# Altium schematic sheet LM317.SchDoc
size A4
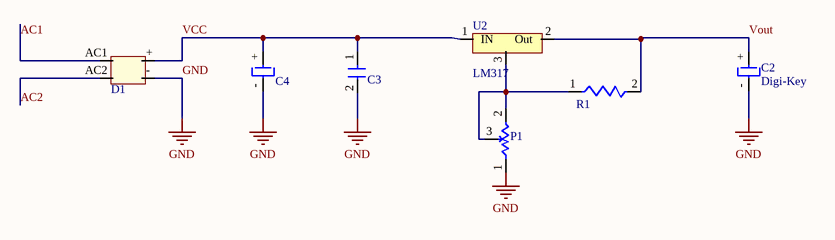
[diagram p0: LM317.SchDoc]

## Parts
C2  Digi-Key  [Cap2]
C3  Cap  [Cap1]  (value not drawn)
C4  2200uF  [CAP3]  (value not drawn)
D1  KoptuDiyot  [2W10]  (value not drawn)
P1  Pot  [Pot]  (value not drawn)
R1  Res  [R1]  (value not drawn)
U2  LM317  [TO220]

## Nets
GND: C2.- C3.2 C4.- D1.- P1.1
AC1: D1.AC1
AC2: D1.AC2
VCC: C3.1 C4.+ D1.+ U2.1(IN)
Vout: C2.+ R1.2 U2.2(Out)
NetP1_2: P1.2 P1.3 R1.1 U2.3

## Library data of the parts
C2 = B0510-2R5224-R: CAP SUPER 0.22F 2.5V RADIAL; Manufacturer: Eaton Bussmann; Capacitance: 220mF; Tolerance: -20%, +80%; ESR (Equivalent Series Resistance): 2 Ohm; Lifetime @ Temp.: 1000 Hrs @ 70°C; Supplier 1: Digi-Key; Manufacturer Part Number: B0510-2R5224-R; RoHS: RoHS Compliant; Category: Capacitors; Stock 1: 17500; Pricing 1: 1=1.67, 10=1.32, 50=1.144, 100=0.99, 500=0.748, 1000=0.66, 5000=0.594, 10000=0.572, 25000=0.55 (USD); Packaging: Bulk; Voltage - Rated: 2.5V; Mounting Type: Through Hole; Package / Case: Radial, Can; Lead Spacing: 0.079" (2.00mm); Size / Dimension: 0.217" Dia (5.50mm); Height - Seated (Max): 0.472" (12.00mm); Operating Temperature: -25°C ~ 70°C; ComponentLink1URL: http://www.cooperindustries.com/content/dam/public/bussmann/Electronics/Resources/product-datasheets/Bus_Elx_DS_4390_B_Series.pdf; ComponentLink1Description: http://www.cooperindustries.com/content/dam/public/bussmann/Electronics/Resources/product-datasheets/Bus_Elx_DS_4390_B_Series.pdf
C3 = R82DC3100DQ50J: CAP FILM 0.1UF 63VDC RADIAL; Manufacturer: Kemet; Capacitance: 0.1µF; Tolerance: ±5%; Voltage Rating - AC: 40V; Voltage Rating - DC: 63V; Dielectric Material: Polyester, Metallized - Stacked; Supplier 1: Digi-Key; Manufacturer Part Number: R82DC3100DQ50J; RoHS: RoHS Compliant; Category: Capacitors; Stock 1: 250000; Pricing 1: 3500=0.0582, 7000=0.05384, 10500=0.05092, 17500=0.04831, 24500=0.04656, 87500=0.04365, 175000=0.03856 (USD); Packaging: Tape & Box (TB); ESR (Equivalent Series Resistance): -; Operating Temperature: -55°C ~ 105°C; Mounting Type: Through Hole; Package / Case: Radial; Size / Dimension: 0.283" L x 0.098" W (7.20mm x 2.50mm); Height - Seated (Max): 0.260" (6.60mm); Termination: PC Pins; Lead Spacing: 0.197" (5.00mm); Applications: General Purpose; Features: -; ComponentLink1URL: http://www.kemet.com/docfinder?Partnumber=R82; ComponentLink1Description: http://www.kemet.com/docfinder?Partnumber=R82
C4 = ECA-1VM222: CAP ALUM 2200UF 35V 20% RADIAL; Manufacturer: Panasonic Electronic Components; Capacitance: 2200µF; Lifetime @ Temp.: 2000 Hrs @ 85°C; Ripple Current: 1.25A; Supplier 1: Digi-Key; Manufacturer Part Number: ECA-1VM222; RoHS: RoHS Compliant; Category: Capacitors; Stock 1: 3193; Pricing 1: 1=1.13, 50=0.7724, 100=0.6685, 500=0.50508, 1000=0.44565, 5000=0.40109, 10000=0.38623, 25000=0.37138 (USD); Packaging: Bulk; Tolerance: ±20%; Voltage Rating: 35V; ESR (Equivalent Series Resistance): -; Operating Temperature: -40°C ~ 85°C; Type: -; Applications: General Purpose; Impedance: -; Lead Spacing: 0.295" (7.50mm); Size / Dimension: 0.630" Dia (16.00mm); Height - Seated (Max): 1.063" (27.00mm); Surface Mount Land Size: -; Mounting Type: Through Hole; Package / Case: Radial, Can; ComponentLink1URL: http://industrial.panasonic.com/www-cgi/jvcr13pz.cgi?E+PZ+3+ABA0012+ECA1VM222+7+WW; ComponentLink1Description: http://industrial.panasonic.com/www-cgi/jvcr13pz.cgi?E+PZ+3+ABA0012+ECA1VM222+7+WW
D1 = 2W10G-E4/51: RECTIFIER BRIDGE 2A 1000V WOG; Manufacturer: Vishay Semiconductor Diodes Division; Diode Type: Single Phase; Supplier 1: Digi-Key; Manufacturer Part Number: 2W10G-E4/51; RoHS: Request Inventory Verification; Category: Discrete Semiconductor Products; Stock 1: 0; Pricing 1: 1=0.69, 10=0.605, 25=0.536, 100=0.4668, 250=0.40632, 500=0.3458, 1000=0.27664, 2500=0.2507 (USD); Packaging: Bulk; Voltage - Peak Reverse (Max): 1000V; Current - DC Forward (If) (Max): 2A; Mounting Type: Through Hole; Package / Case: 4-Circular, WOG; Supplier Device Package: WOG; ComponentLink1URL: http://www.vishay.com/docs/88528/2w005g.pdf; ComponentLink1Description: http://www.vishay.com/docs/88528/2w005g.pdf
P1 = 3310C-001-103L: POT 10K OHM 9MM SQ RTANG PLAST; Manufacturer: Bourns Inc.; Power (Watts): 0.25W, 1/4W; Tolerance: ±20%; Temperature Coefficient: ±1000ppm/°C; Number of Turns: Single; Rotation: 300°; Adjustment Type: Side Adjustment; Resistive Material: Conductive Plastic; Actuator Length: 0.500" (12.70mm); Actuator Type: Slotted Shaft; Actuator Diameter: 0.125" (3.18mm); Supplier 1: Digi-Key; Manufacturer Part Number: 3310C-001-103L; RoHS: RoHS Compliant; Category: Potentiometers, Variable Resistors; Stock 1: 2537; Pricing 1: 1=2.64, 10=2.32, 25=2.08, 50=2, 100=1.92, 250=1.84, 500=1.52, 1000=1.44, 2500=1.24 (USD); Packaging: Bulk; Resistance (Ohms): 10k; Termination Style: PC Pin; Size - Body: Square - 0.375" x 0.375" Face x 0.375" H (9.53mm x 9.53mm x 9.53mm); Mounting Type: Through Hole; ComponentLink1URL: http://www.bourns.com/data/global/pdfs/3310.pdf; ComponentLink1Description: http://www.bourns.com/data/global/pdfs/3310.pdf
R1 = CF14JT10K0: RES 10K OHM 1/4W 5% CARBON FILM; Manufacturer: Stackpole Electronics Inc; Power (Watts): 0.25W, 1/4W; Temperature Coefficient: 0/ -500ppm/°C; Supplier 1: Digi-Key; Manufacturer Part Number: CF14JT10K0; RoHS: RoHS Compliant; Category: Resistors; Stock 1: 600000; Pricing 1: 5000=0.00475, 10000=0.00413, 25000=0.00363, 50000=0.00333, 125000=0.00326 (USD); Packaging: Tape & Reel (TR); Resistance (Ohms): 10k; Tolerance: ±5%; Composition: Carbon Film; Features: Flame Retardant Coating, Moisture Resistant; Operating Temperature: -55°C ~ 155°C; Package / Case: Axial; Supplier Device Package: Axial; Size / Dimension: 0.091" Dia x 0.256" L (2.30mm x 6.50mm); Height: -; Number of Terminations: 2; ComponentLink1URL: http://www.seielect.com/catalog/SEI-CF_CFM.pdf; ComponentLink1Description: http://www.seielect.com/catalog/SEI-CF_CFM.pdf
U2 = LM317TG: Linear Voltage Regulators 1.5A ADJ 1.2-37V Positive; pin to pad: 1>3 3>1; Manufacturer: ON Semiconductor; Input Voltage MAX: 40 V; Number of Outputs: 1; Output Type: Adjustable; Output Voltage: 1.2 V to 37 V; PSRR / Ripple Rejection - Typ: 80 dB; Input Voltage MIN: 4.2 V; Line Regulation: 0.04 % / V; Load Regulation: 0.5 % / V; Supplier 1: Mouser; Manufacturer Part Number: LM317TG; RoHS: RoHS Compliant; Category: Linear Voltage Regulators; Stock 1: 8592; Pricing 1: 1=0.783, 10=0.571, 100=0.359, 1000=0.277, 2500=0.236, 10000=0.220, 25000=0.209, 50000=0.204 (AUD); Output Current: 1.5 A; Package / Case: TO-220; Packaging: Tube; Series: LM317; Brand: ON Semiconductor; Mounting Style: Through Hole; Maximum Operating Temperature: + 125 C; Minimum Operating Temperature: 0 C; Polarity: Positive; Product Category: Linear Regulators- General Purpose; Standard Pack Qty: 50; RoHS - Mouser: Y; Minimum Order Quantity: 1; Reeling: False; ComponentLink1URL: http://www.mouser.com/ds/2/308/LM317-D-111941.pdf; ComponentLink1Description: http://www.mouser.com/ds/2/308/LM317-D-111941.pdf